# EAGLE design mgpcbw02 (EAGLE 7.6.0)
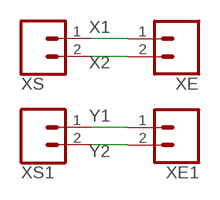
[diagram p0: schematic, sheet 1]

## Parts
XE  CONN_021X02_NO_SILK  [1X02_NO_SILK]
XE1  CONN_021X02_NO_SILK  [1X02_NO_SILK]
XS  CONN_021X02_NO_SILK  [1X02_NO_SILK]
XS1  CONN_021X02_NO_SILK  [1X02_NO_SILK]

## Nets
X1: XE.1 XS.1
X2: XE.2 XS.2
Y1: XE1.1 XS1.1
Y2: XE1.2 XS1.2

## Library data of the parts
XE XE1 XS XS1 = SparkFun-Connectors:CONN_02: Multi connection point. Often used as Generic Header-pin footprint for 0.1 inch spaced/style header connections On any of the 0.1 inch spaced packages, you can populate with these: Break Away Headers - Straight <https://www.sparkfun.com/products/116> (PRT-00116) Break Away Male Headers - Right Angle <https://www.sparkfun.com/products/553> (PRT-00553) Female Headers <https://www.sparkfun.com/products/115> (PRT-00115) Break Away Headers - Machine Pin <https://www.sparkfun.com/products/117> (PRT-00117) Break Away Female Headers - Swiss Machine Pin <https://www.sparkfun.com/products/743> (PRT-00743) For SCREWTERMINALS and SPRING TERMINALS visit here: Screw Terimnals on SparkFun.com <https://www.sparkfun.com/search/results?term=Screw+Terminals> (5mm/3.5mm/2.54mm spacing) This device is also useful as a general connection point to wire up your design to another part of your project. Our various solder wires solder well into these plated through hole pads. Hook-Up Wire - Assortment (Stranded, 22 AWG) <https://www.sparkfun.com/products/11375> (PRT-11375) Hook-Up Wire - Assortment (Solid Core, 22 AWG) <https://www.sparkfun.com/products/11367> (PRT-11367) View the entire wire category on our website here <https://www.sparkfun.com/categories/141> Special notes: Molex polarized connector foot print use with: PRT-08233 with associated crimp pins and housings. 2.54_SCREWTERM for use with PRT-10571. 3.5mm Screw Terminal footprints for PRT-08084 5mm Screw Terminal footprints for use with PRT-08432

## Net classes
0 default: width 0.203 mm, drill 0.381 mm, clearance 0.203 mm
1 vcc: width 0.305 mm, drill 0.381 mm, clearance 0.254 mm
2 gnd: width 0.305 mm, drill 0.381 mm, clearance 0.254 mm

## Board
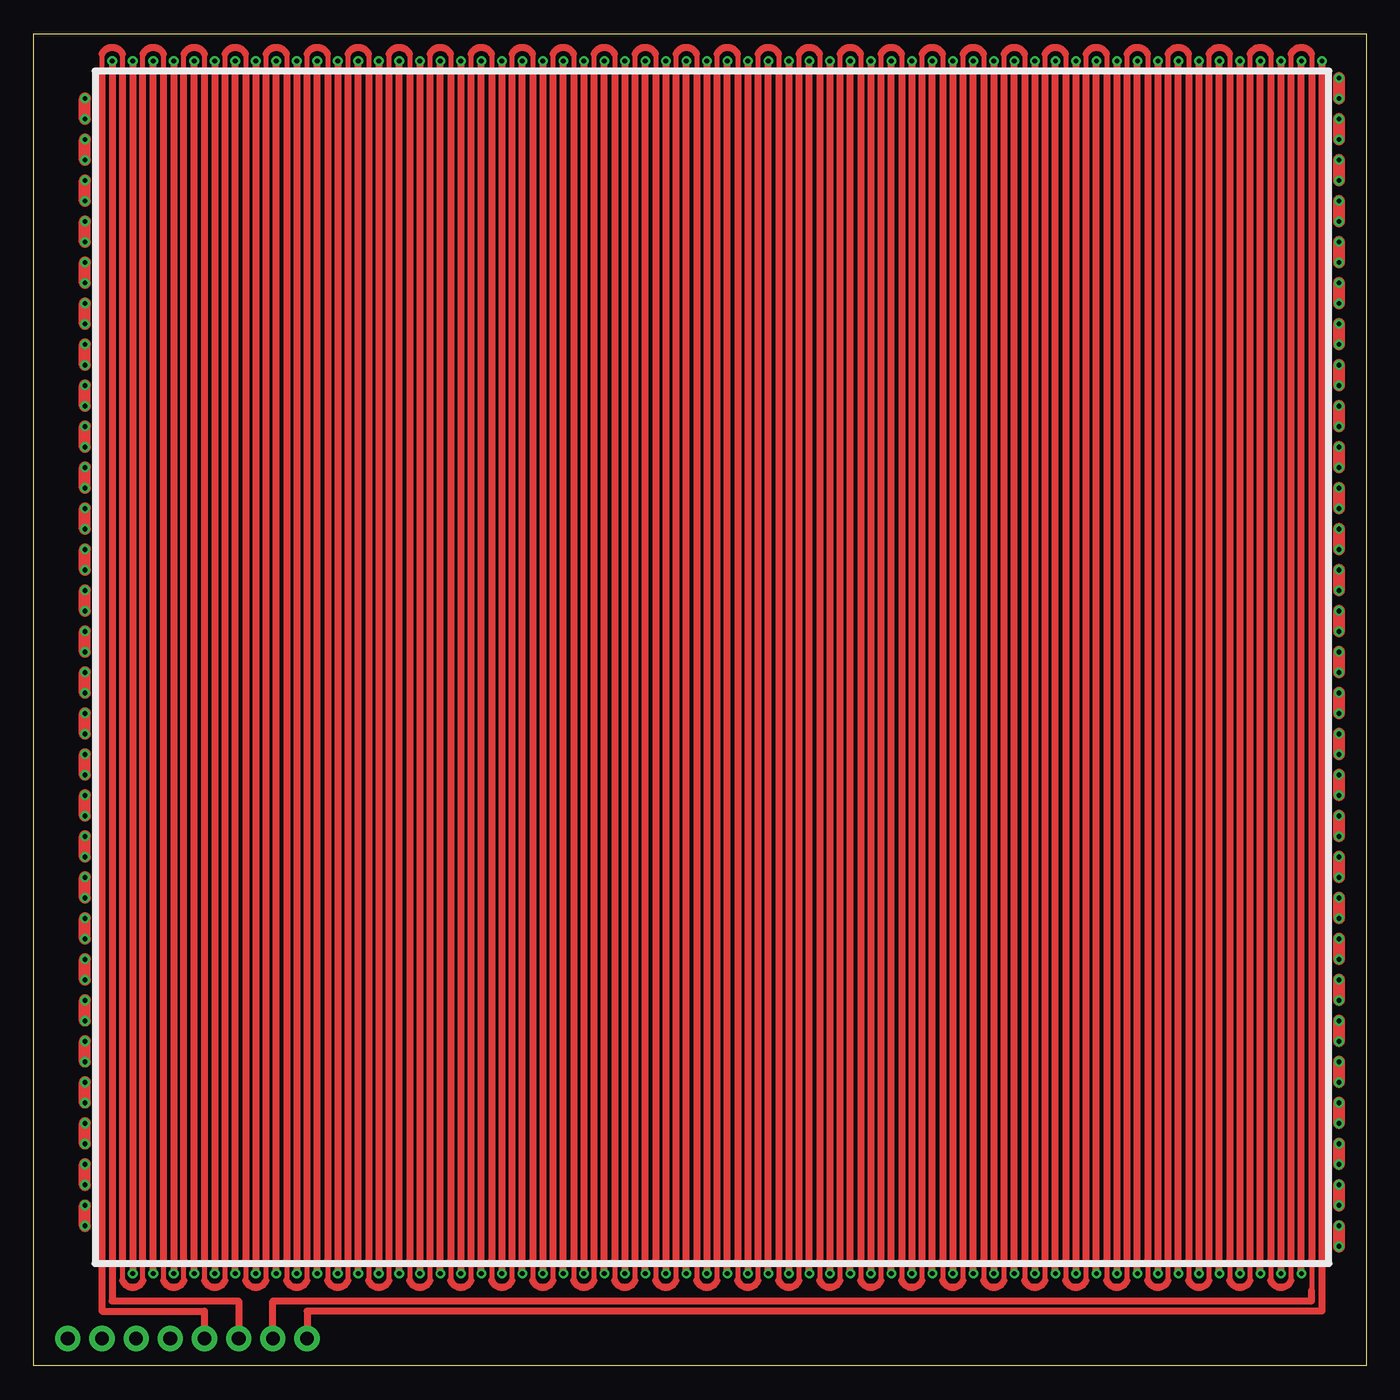
[diagram p1: board, top side]
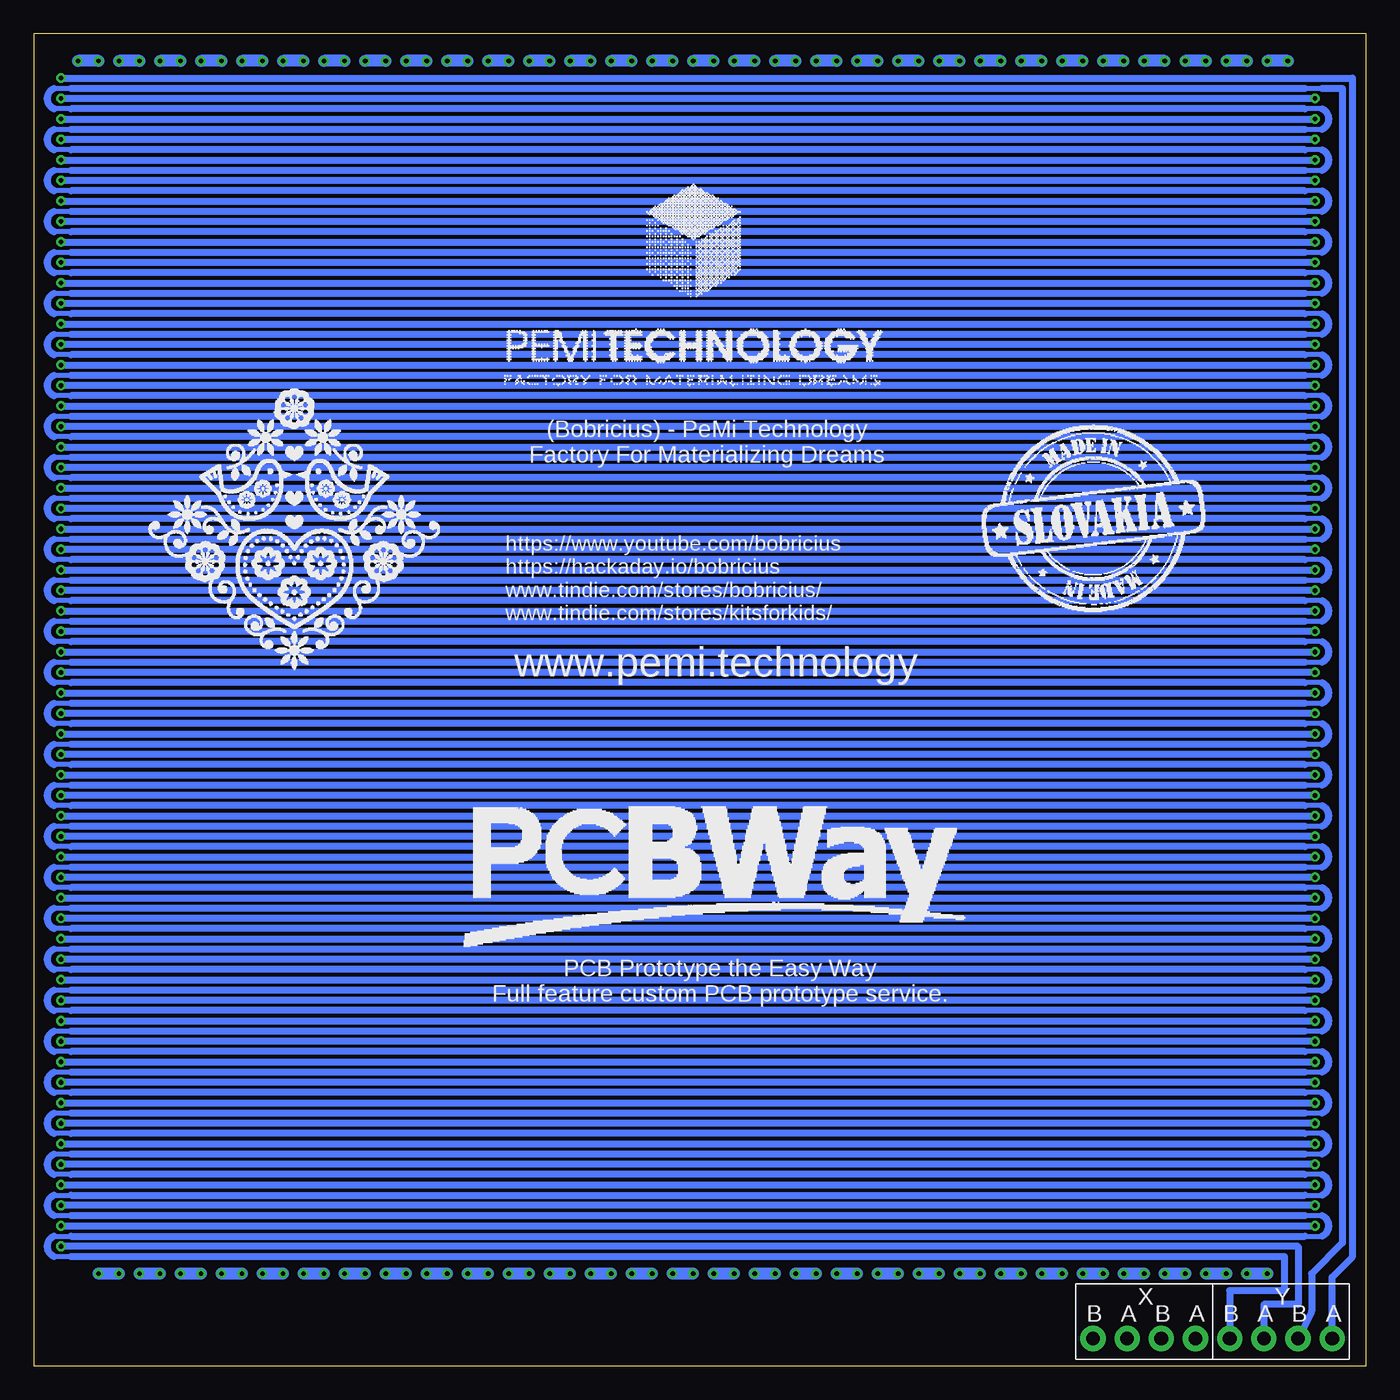
[diagram p2: board, bottom side, seen from below]

Size 99.06 x 99.06 mm. Coordinates in mm from the lower left corner, seen from the top.
Outline: 0,99.06 99.06,99.06 99.06,0 0,0 0,99.06
Copper layers (1*16): Top 0.0356mm / dielectric 1.5011mm / Bottom 0.0356mm
Design rules "LaenPCBOrder *": minimum track width 6mil, minimum drill 13mil, track to track 6mil, track to pad 6mil, pad to pad 6mil, via to via 6mil, smd to smd 6mil, copper to edge 15mil, drill to drill 6mil, minimum pad ring 7mil, minimum via ring 7mil, stop-mask expansion 4mil, vias tented up to drill 100mil, thermal gap 10mil

### Footprints (pad centres in the part's own frame; a part is rotated, then mirrored left to right if it is on the bottom)
1X02_NO_SILK = drill 1.016 pad 1.88: 1 0,0; 2 2.54,0

### Placement (x,y rotation side)
XE  17.78,2.03 0 top
XE1  10.16,2.03 180 top
XS  12.7,2.03 0 top
XS1  5.08,2.03 180 top

### Tracks (layer width: path | path; a pad name or v marks a point on that pad's centre or on a via)
X1
  Top 0.381: 6.6,97.54 6.6,96.27 | 6.6,7.87 6.6,6.35 | 8.13,6.35 8.13,7.87 | 8.13,96.27 8.13,97.54 | 9.65,97.54 9.65,96.27 | 9.65,7.87 9.65,6.35 | 11.18,6.35 11.18,7.87 | 11.18,96.27 11.18,97.54 | 12.7,97.54 12.7,96.27 | 12.7,7.87 12.7,6.35 | 14.22,6.35 14.22,7.87 | 14.22,96.27 14.22,97.54 | 15.75,97.54 15.75,96.27 | 15.75,7.87 15.75,6.35 | 17.27,6.35 17.27,7.87 | 17.27,96.27 17.27,97.54 | 18.8,97.54 18.8,96.27 | 18.8,7.87 18.8,6.35 | 20.32,6.35 20.32,7.87 | 20.32,96.27 20.32,97.54 | 21.84,97.54 21.84,96.27 | 21.84,7.87 21.84,6.35 | 23.37,6.35 23.37,7.87 | 23.37,96.27 23.37,97.54 | 24.89,97.54 24.89,96.27 | 24.89,7.87 24.89,6.35 | 26.42,6.35 26.42,7.87 | 26.42,96.27 26.42,97.54 | 27.94,97.54 27.94,96.27 | 27.94,7.87 27.94,6.35 | 29.46,6.35 29.46,7.87 | 29.46,96.27 29.46,97.54 | 30.99,97.54 30.99,96.27 | 30.99,7.87 30.99,6.35 | 32.51,6.35 32.51,7.87 | 32.51,96.27 32.51,97.54 | 34.04,97.54 34.04,96.27 | 34.04,7.87 34.04,6.35 | 35.56,6.35 35.56,7.87 | 35.56,96.27 35.56,97.54 | 37.08,97.54 37.08,96.27 | 37.08,7.87 37.08,6.35 | 38.61,6.35 38.61,7.87 | 38.61,96.27 38.61,97.54 | 40.13,97.54 40.13,96.27 | 40.13,7.87 40.13,6.35 | 41.66,6.35 41.66,7.87 | 41.66,96.27 41.66,97.54 | 43.18,97.54 43.18,96.27 | 43.18,7.87 43.18,6.35 | 44.7,6.35 44.7,7.87 | 44.7,96.27 44.7,97.54 | 46.23,97.54 46.23,96.27 | 46.23,7.87 46.23,6.35 | 47.75,6.35 47.75,7.87 | 47.75,96.27 47.75,97.54 | 49.28,97.54 49.28,96.27 | 49.28,7.87 49.28,6.35 | 50.8,6.35 50.8,7.87 | 50.8,96.27 50.8,97.54 | 52.32,97.54 52.32,96.27 | 52.32,7.87 52.32,6.35 | 53.85,6.35 53.85,7.87 | 53.85,96.27 53.85,97.54 | 55.37,97.54 55.37,96.27 | 55.37,7.87 55.37,6.35 | 56.9,6.35 56.9,7.87 | 56.9,96.27 56.9,97.54 | 58.42,97.54 58.42,96.27 | 58.42,7.87 58.42,6.35
  Top 0.381: 59.94,6.35 59.94,7.87 | 59.94,96.27 59.94,97.54 | 61.47,97.54 61.47,96.27 | 61.47,7.87 61.47,6.35 | 62.99,6.35 62.99,7.87 | 62.99,96.27 62.99,97.54 | 64.52,97.54 64.52,96.27 | 64.52,7.87 64.52,6.35 | 66.04,6.35 66.04,7.87 | 66.04,96.27 66.04,97.54 | 67.56,97.54 67.56,96.27 | 67.56,7.87 67.56,6.35 | 69.09,6.35 69.09,7.87 | 69.09,96.27 69.09,97.54 | 70.61,97.54 70.61,96.27 | 70.61,7.87 70.61,6.35 | 72.14,6.35 72.14,7.87 | 72.14,96.27 72.14,97.54 | 73.66,97.54 73.66,96.27 | 73.66,7.87 73.66,6.35 | 75.18,6.35 75.18,7.87 | 75.18,96.27 75.18,97.54 | 76.71,97.54 76.71,96.27 | 76.71,7.87 76.71,6.35 | 78.23,6.35 78.23,7.87 | 78.23,96.27 78.23,97.54 | 5.08,97.54 5.08,96.27 | 79.76,97.54 79.76,96.27 | 79.76,7.87 79.76,6.35 | 81.28,6.35 81.28,7.87 | 81.28,96.27 81.28,97.54 | 82.8,97.54 82.8,96.27 | 82.8,7.87 82.8,6.35 | 84.33,6.35 84.33,7.87 | 84.33,96.27 84.33,97.54 | 85.85,97.54 85.85,96.27 | 85.85,7.87 85.85,6.35 | 87.38,6.35 87.38,7.87 | 87.38,96.27 87.38,97.54 | 88.9,97.54 88.9,96.27 | 88.9,7.87 88.9,6.35 | 90.42,6.35 90.42,7.87 | 90.42,96.27 90.42,97.54 | 91.95,97.54 91.95,96.27 | 91.95,7.87 91.95,6.35 | 93.47,6.35 93.47,7.87 | 93.47,96.27 93.47,97.54 | 95,97.54 95,96.27 | 95,7.87 95,5.59
  Top 0.508: 5.08,97.54 arc-135 6.6,97.54 | 6.6,96.27 6.6,7.87 | 6.6,6.35 arc135 8.13,6.35 | 8.13,7.87 8.13,96.27 | 8.13,97.54 arc-135 9.65,97.54 | 9.65,96.27 9.65,7.87 | 9.65,6.35 arc135 11.18,6.35 | 11.18,7.87 11.18,96.27 | 11.18,97.54 arc-135 12.7,97.54 | 12.7,96.27 12.7,7.87 | 12.7,6.35 arc135 14.22,6.35 | 14.22,7.87 14.22,96.27 | 14.22,97.54 arc-135 15.75,97.54 | 15.75,96.27 15.75,7.87 | 15.75,6.35 arc135 17.27,6.35 | 17.27,7.87 17.27,96.27 | 17.27,97.54 arc-135 18.8,97.54 | 18.8,96.27 18.8,7.87 | 18.8,6.35 arc135 20.32,6.35 | 20.32,7.87 20.32,96.27 | 20.32,97.54 arc-135 21.84,97.54 | 21.84,96.27 21.84,7.87 | 21.84,6.35 arc135 23.37,6.35 | 23.37,7.87 23.37,96.27 | 23.37,97.54 arc-135 24.89,97.54 | 24.89,96.27 24.89,7.87 | 24.89,6.35 arc135 26.42,6.35 | 26.42,7.87 26.42,96.27 | 26.42,97.54 arc-135 27.94,97.54 | 27.94,96.27 27.94,7.87 | 27.94,6.35 arc135 29.46,6.35 | 29.46,7.87 29.46,96.27 | 29.46,97.54 arc-135 30.99,97.54 | 30.99,96.27 30.99,7.87 | 30.99,6.35 arc135 32.51,6.35 | 32.51,7.87 32.51,96.27 | 32.51,97.54 arc-135 34.04,97.54 | 34.04,96.27 34.04,7.87 | 34.04,6.35 arc135 35.56,6.35 | 35.56,7.87 35.56,96.27 | 35.56,97.54 arc-135 37.08,97.54 | 37.08,96.27 37.08,7.87 | 37.08,6.35 arc135 38.61,6.35 | 38.61,7.87 38.61,96.27 | 38.61,97.54 arc-135 40.13,97.54 | 40.13,96.27 40.13,7.87 | 40.13,6.35 arc135 41.66,6.35 | 41.66,7.87 41.66,96.27 | 41.66,97.54 arc-135 43.18,97.54 | 43.18,96.27 43.18,7.87 | 43.18,6.35 arc135 44.7,6.35 | 44.7,7.87 44.7,96.27 | 44.7,97.54 arc-135 46.23,97.54 | 46.23,96.27 46.23,7.87 | 46.23,6.35 arc135 47.75,6.35 | 47.75,7.87 47.75,96.27 | 47.75,97.54 arc-135 49.28,97.54 | 49.28,96.27 49.28,7.87 | 49.28,6.35 arc135 50.8,6.35 | 50.8,7.87 50.8,96.27
  Top 0.508: 50.8,97.54 arc-135 52.32,97.54 | 52.32,96.27 52.32,7.87 | 52.32,6.35 arc135 53.85,6.35 | 53.85,7.87 53.85,96.27 | 53.85,97.54 arc-135 55.37,97.54 | 55.37,96.27 55.37,7.87 | 55.37,6.35 arc135 56.9,6.35 | 56.9,7.87 56.9,96.27 | 56.9,97.54 arc-135 58.42,97.54 | 58.42,96.27 58.42,7.87 | 58.42,6.35 arc135 59.94,6.35 | 59.94,7.87 59.94,96.27 | 59.94,97.54 arc-135 61.47,97.54 | 61.47,96.27 61.47,7.87 | 61.47,6.35 arc135 62.99,6.35 | 62.99,7.87 62.99,96.27 | 62.99,97.54 arc-135 64.52,97.54 | 64.52,96.27 64.52,7.87 | 64.52,6.35 arc135 66.04,6.35 | 66.04,7.87 66.04,96.27 | 66.04,97.54 arc-135 67.56,97.54 | 67.56,96.27 67.56,7.87 | 67.56,6.35 arc135 69.09,6.35 | 69.09,7.87 69.09,96.27 | 69.09,97.54 arc-135 70.61,97.54 | 70.61,96.27 70.61,7.87 | 70.61,6.35 arc135 72.14,6.35 | 72.14,7.87 72.14,96.27 | 72.14,97.54 arc-135 73.66,97.54 | 73.66,96.27 73.66,7.87 | 73.66,6.35 arc135 75.18,6.35 | 75.18,7.87 75.18,96.27 | 75.18,97.54 arc-135 76.71,97.54 | 76.71,96.27 76.71,7.87 | 76.71,6.35 arc135 78.23,6.35 | 78.23,7.87 78.23,96.27 | 5.08,96.27 5.08,4.06 12.7,4.06 XS.1 | 78.23,97.54 arc-135 79.76,97.54 | 79.76,96.27 79.76,7.87 | 79.76,6.35 arc135 81.28,6.35 | 81.28,7.87 81.28,96.27 | 81.28,97.54 arc-135 82.8,97.54 | 82.8,96.27 82.8,7.87 | 82.8,6.35 arc135 84.33,6.35 | 84.33,7.87 84.33,96.27 | 84.33,97.54 arc-135 85.85,97.54 | 85.85,96.27 85.85,7.87 | 85.85,6.35 arc135 87.38,6.35 | 87.38,7.87 87.38,96.27 | 87.38,97.54 arc-135 88.9,97.54 | 88.9,96.27 88.9,7.87 | 88.9,6.35 arc135 90.42,6.35 | 90.42,7.87 90.42,96.27 | 90.42,97.54 arc-135 91.95,97.54 | 91.95,96.27 91.95,7.87 | 91.95,6.35 arc135 93.47,6.35 | 93.47,7.87 93.47,96.27 | 93.47,97.54 arc-135 95,97.54 | 95,96.27 95,7.87
  Top 0.508: XE.1 17.78,4.83 95,4.83 95,5.59
X2  (via drill 0.36, 0.36 pad 0.51)
  Top 0.508: v7.37,97.03 v7.37,6.86 | v8.89,6.86 v8.89,97.03 | v10.41,97.03 v10.41,6.86 | v11.94,6.86 v11.94,97.03 | v13.46,97.03 v13.46,6.86 | v14.99,6.86 v14.99,97.03 | v16.51,97.03 v16.51,6.86 | v18.03,6.86 v18.03,97.03 | v19.56,97.03 v19.56,6.86 | v21.08,6.86 v21.08,97.03 | v22.61,97.03 v22.61,6.86 | v24.13,6.86 v24.13,97.03 | v25.65,97.03 v25.65,6.86 | v27.18,6.86 v27.18,97.03 | v28.7,97.03 v28.7,6.86 | v30.23,6.86 v30.23,97.03 | v31.75,97.03 v31.75,6.86 | v33.27,6.86 v33.27,97.03 | v34.8,97.03 v34.8,6.86 | v36.32,6.86 v36.32,97.03 | v37.85,97.03 v37.85,6.86 | v39.37,6.86 v39.37,97.03 | v40.89,97.03 v40.89,6.86 | v42.42,6.86 v42.42,97.03 | v43.94,97.03 v43.94,6.86 | v45.47,6.86 v45.47,97.03 | v46.99,97.03 v46.99,6.86 | v48.51,6.86 v48.51,97.03 | v50.04,97.03 v50.04,6.86 | v51.56,6.86 v51.56,97.03 | v53.09,97.03 v53.09,6.86 | v54.61,6.86 v54.61,97.03 | v56.13,97.03 v56.13,6.86 | v57.66,6.86 v57.66,97.03 | v59.18,97.03 v59.18,6.86 | v60.71,6.86 v60.71,97.03 | v62.23,97.03 v62.23,6.86 | v63.75,6.86 v63.75,97.03 | v65.28,97.03 v65.28,6.86 | v66.8,6.86 v66.8,97.03 | v68.33,97.03 v68.33,6.86 | v69.85,6.86 v69.85,97.03 | v71.37,97.03 v71.37,6.86 | v72.9,6.86 v72.9,97.03 | v74.42,97.03 v74.42,6.86 | v75.95,6.86 v75.95,97.03 | v77.47,97.03 v77.47,6.86 | v78.99,6.86 v78.99,97.03 | v5.84,97.03 5.84,4.83 15.24,4.83 XS.2 | v80.52,97.03 v80.52,6.86 | v82.04,6.86 v82.04,97.03 | v83.57,97.03 v83.57,6.86 | v85.09,6.86 v85.09,97.03 | v86.61,97.03 v86.61,6.86 | v88.14,6.86 v88.14,97.03 | v89.66,97.03 v89.66,6.86 | v91.19,6.86 v91.19,97.03 | v92.71,97.03 v92.71,6.86 | v94.23,6.86 v94.23,97.03 | v95.76,97.03 95.76,4.06 20.32,4.06 XE.2
  Bottom 0.889: v5.84,97.03 v7.37,97.03 | v7.37,6.86 v8.89,6.86 | v8.89,97.03 v10.41,97.03 | v10.41,6.86 v11.94,6.86 | v11.94,97.03 v13.46,97.03 | v13.46,6.86 v14.99,6.86 | v14.99,97.03 v16.51,97.03 | v16.51,6.86 v18.03,6.86 | v18.03,97.03 v19.56,97.03 | v19.56,6.86 v21.08,6.86 | v21.08,97.03 v22.61,97.03 | v22.61,6.86 v24.13,6.86 | v24.13,97.03 v25.65,97.03 | v25.65,6.86 v27.18,6.86 | v27.18,97.03 v28.7,97.03 | v28.7,6.86 v30.23,6.86 | v30.23,97.03 v31.75,97.03 | v31.75,6.86 v33.27,6.86 | v33.27,97.03 v34.8,97.03 | v34.8,6.86 v36.32,6.86 | v36.32,97.03 v37.85,97.03 | v37.85,6.86 v39.37,6.86 | v39.37,97.03 v40.89,97.03 | v40.89,6.86 v42.42,6.86 | v42.42,97.03 v43.94,97.03 | v43.94,6.86 v45.47,6.86 | v45.47,97.03 v46.99,97.03 | v46.99,6.86 v48.51,6.86 | v48.51,97.03 v50.04,97.03 | v50.04,6.86 v51.56,6.86 | v51.56,97.03 v53.09,97.03 | v53.09,6.86 v54.61,6.86 | v54.61,97.03 v56.13,97.03 | v56.13,6.86 v57.66,6.86 | v57.66,97.03 v59.18,97.03 | v59.18,6.86 v60.71,6.86 | v60.71,97.03 v62.23,97.03 | v62.23,6.86 v63.75,6.86 | v63.75,97.03 v65.28,97.03 | v65.28,6.86 v66.8,6.86 | v66.8,97.03 v68.33,97.03 | v68.33,6.86 v69.85,6.86 | v69.85,97.03 v71.37,97.03 | v71.37,6.86 v72.9,6.86 | v72.9,97.03 v74.42,97.03 | v74.42,6.86 v75.95,6.86 | v75.95,97.03 v77.47,97.03 | v77.47,6.86 v78.99,6.86 | v78.99,97.03 v80.52,97.03 | v80.52,6.86 v82.04,6.86 | v82.04,97.03 v83.57,97.03 | v83.57,6.86 v85.09,6.86 | v85.09,97.03 v86.61,97.03 | v86.61,6.86 v88.14,6.86 | v88.14,97.03 v89.66,97.03 | v89.66,6.86 v91.19,6.86 | v91.19,97.03 v92.71,97.03 | v92.71,6.86 v94.23,6.86 | v94.23,97.03 v95.76,97.03
Y1
  Bottom 0.381: 96.27,8.13 97.54,8.13 | 97.54,9.65 96.27,9.65 | 4.57,9.65 3.3,9.65 | 3.3,11.18 4.57,11.18 | 96.27,11.18 97.54,11.18 | 97.54,12.7 96.27,12.7 | 4.57,12.7 3.3,12.7 | 3.3,14.22 4.57,14.22 | 96.27,14.22 97.54,14.22 | 97.54,15.75 96.27,15.75 | 4.57,15.75 3.3,15.75 | 3.3,17.27 4.57,17.27 | 96.27,17.27 97.54,17.27 | 97.54,18.8 96.27,18.8 | 4.57,18.8 3.3,18.8 | 3.3,20.32 4.57,20.32 | 96.27,20.32 97.54,20.32 | 97.54,21.84 96.27,21.84 | 4.57,21.84 3.3,21.84 | 3.3,23.37 4.57,23.37 | 96.27,23.37 97.54,23.37 | 97.54,24.89 96.27,24.89 | 4.57,24.89 3.3,24.89 | 3.3,26.42 4.57,26.42 | 96.27,26.42 97.54,26.42 | 97.54,27.94 96.27,27.94 | 4.57,27.94 3.3,27.94 | 3.3,29.46 4.57,29.46 | 96.27,29.46 97.54,29.46 | 97.54,30.99 96.27,30.99 | 4.57,30.99 3.3,30.99 | 3.3,32.51 4.57,32.51 | 96.27,32.51 97.54,32.51 | 97.54,34.04 96.27,34.04 | 4.57,34.04 3.3,34.04 | 3.3,35.56 4.57,35.56 | 96.27,35.56 97.54,35.56 | 97.54,37.08 96.27,37.08 | 4.57,37.08 3.3,37.08 | 3.3,38.61 4.57,38.61 | 96.27,38.61 97.54,38.61 | 97.54,40.13 96.27,40.13 | 4.57,40.13 3.3,40.13 | 3.3,41.66 4.57,41.66 | 96.27,41.66 97.54,41.66 | 97.54,43.18 96.27,43.18 | 4.57,43.18 3.3,43.18 | 3.3,44.7 4.57,44.7 | 96.27,44.7 97.54,44.7 | 97.54,46.23 96.27,46.23 | 4.57,46.23 3.3,46.23 | 3.3,47.75 4.57,47.75 | 96.27,47.75 97.54,47.75 | 97.54,49.28 96.27,49.28 | 4.57,49.28 3.3,49.28 | 3.3,50.8 4.57,50.8 | 96.27,50.8 97.54,50.8 | 97.54,52.32 96.27,52.32 | 4.57,52.32 3.3,52.32 | 3.3,53.85 4.57,53.85 | 96.27,53.85 97.54,53.85 | 97.54,55.37 96.27,55.37 | 4.57,55.37 3.3,55.37 | 3.3,56.9 4.57,56.9 | 96.27,56.9 97.54,56.9 | 97.54,58.42 96.27,58.42 | 4.57,58.42 3.3,58.42 | 3.3,59.94 4.57,59.94 | 96.27,59.94 97.54,59.94 | 97.54,61.47 96.27,61.47 | 4.57,61.47 3.3,61.47
  Bottom 0.381: 3.3,62.99 4.57,62.99 | 96.27,62.99 97.54,62.99 | 97.54,64.52 96.27,64.52 | 4.57,64.52 3.3,64.52 | 3.3,66.04 4.57,66.04 | 96.27,66.04 97.54,66.04 | 97.54,67.56 96.27,67.56 | 4.57,67.56 3.3,67.56 | 3.3,69.09 4.57,69.09 | 96.27,69.09 97.54,69.09 | 97.54,70.61 96.27,70.61 | 4.57,70.61 3.3,70.61 | 3.3,72.14 4.57,72.14 | 96.27,72.14 97.54,72.14 | 97.54,73.66 96.27,73.66 | 4.57,73.66 3.3,73.66 | 3.3,75.18 4.57,75.18 | 96.27,75.18 97.54,75.18 | 97.54,76.71 96.27,76.71 | 4.57,76.71 3.3,76.71 | 3.3,78.23 4.57,78.23 | 96.27,78.23 97.54,78.23 | 97.54,79.76 96.27,79.76 | 4.57,79.76 3.3,79.76 | 3.3,81.28 4.57,81.28 | 96.27,81.28 97.54,81.28 | 97.54,82.8 96.27,82.8 | 4.57,82.8 3.3,82.8 | 3.3,84.33 4.57,84.33 | 96.27,84.33 97.54,84.33 | 97.54,85.85 96.27,85.85 | 4.57,85.85 3.3,85.85 | 3.3,87.38 4.57,87.38 | 96.27,87.38 97.54,87.38 | 97.54,88.9 96.27,88.9 | 4.57,88.9 3.3,88.9 | 3.3,90.42 4.57,90.42 | 96.27,90.42 97.54,90.42 | 97.54,91.95 96.27,91.95 | 4.57,91.95 3.3,91.95 | 3.3,93.47 4.57,93.47 | 96.27,93.47 97.54,93.47 | 97.54,95 96.27,95 | 4.57,95 3.3,95
  Bottom 0.508: 96.27,8.13 6.1,8.13 6.1,5.59 10.16,5.59 XE1.1 | 97.54,8.13 arc135 97.54,9.65 | 96.27,9.65 4.57,9.65 | 3.3,9.65 arc-135 3.3,11.18 | 4.57,11.18 96.27,11.18 | 97.54,11.18 arc135 97.54,12.7 | 96.27,12.7 4.57,12.7 | 3.3,12.7 arc-135 3.3,14.22 | 4.57,14.22 96.27,14.22 | 97.54,14.22 arc135 97.54,15.75 | 96.27,15.75 4.57,15.75 | 3.3,15.75 arc-135 3.3,17.27 | 4.57,17.27 96.27,17.27 | 97.54,17.27 arc135 97.54,18.8 | 96.27,18.8 4.57,18.8 | 3.3,18.8 arc-135 3.3,20.32 | 4.57,20.32 96.27,20.32 | 97.54,20.32 arc135 97.54,21.84 | 96.27,21.84 4.57,21.84 | 3.3,21.84 arc-135 3.3,23.37 | 4.57,23.37 96.27,23.37 | 97.54,23.37 arc135 97.54,24.89 | 96.27,24.89 4.57,24.89 | 3.3,24.89 arc-135 3.3,26.42 | 4.57,26.42 96.27,26.42 | 97.54,26.42 arc135 97.54,27.94 | 96.27,27.94 4.57,27.94 | 3.3,27.94 arc-135 3.3,29.46 | 4.57,29.46 96.27,29.46 | 97.54,29.46 arc135 97.54,30.99 | 96.27,30.99 4.57,30.99 | 3.3,30.99 arc-135 3.3,32.51 | 4.57,32.51 96.27,32.51 | 97.54,32.51 arc135 97.54,34.04 | 96.27,34.04 4.57,34.04 | 3.3,34.04 arc-135 3.3,35.56 | 4.57,35.56 96.27,35.56 | 97.54,35.56 arc135 97.54,37.08 | 96.27,37.08 4.57,37.08 | 3.3,37.08 arc-135 3.3,38.61 | 4.57,38.61 96.27,38.61 | 97.54,38.61 arc135 97.54,40.13 | 96.27,40.13 4.57,40.13 | 3.3,40.13 arc-135 3.3,41.66 | 4.57,41.66 96.27,41.66 | 97.54,41.66 arc135 97.54,43.18 | 96.27,43.18 4.57,43.18 | 3.3,43.18 arc-135 3.3,44.7 | 4.57,44.7 96.27,44.7 | 97.54,44.7 arc135 97.54,46.23 | 96.27,46.23 4.57,46.23 | 3.3,46.23 arc-135 3.3,47.75 | 4.57,47.75 96.27,47.75 | 97.54,47.75 arc135 97.54,49.28 | 96.27,49.28 4.57,49.28 | 3.3,49.28 arc-135 3.3,50.8 | 4.57,50.8 96.27,50.8 | 97.54,50.8 arc135 97.54,52.32 | 96.27,52.32 4.57,52.32 | 3.3,52.32 arc-135 3.3,53.85
  Bottom 0.508: 4.57,53.85 96.27,53.85 | 97.54,53.85 arc135 97.54,55.37 | 96.27,55.37 4.57,55.37 | 3.3,55.37 arc-135 3.3,56.9 | 4.57,56.9 96.27,56.9 | 97.54,56.9 arc135 97.54,58.42 | 96.27,58.42 4.57,58.42 | 3.3,58.42 arc-135 3.3,59.94 | 4.57,59.94 96.27,59.94 | 97.54,59.94 arc135 97.54,61.47 | 96.27,61.47 4.57,61.47 | 3.3,61.47 arc-135 3.3,62.99 | 4.57,62.99 96.27,62.99 | 97.54,62.99 arc135 97.54,64.52 | 96.27,64.52 4.57,64.52 | 3.3,64.52 arc-135 3.3,66.04 | 4.57,66.04 96.27,66.04 | 97.54,66.04 arc135 97.54,67.56 | 96.27,67.56 4.57,67.56 | 3.3,67.56 arc-135 3.3,69.09 | 4.57,69.09 96.27,69.09 | 97.54,69.09 arc135 97.54,70.61 | 96.27,70.61 4.57,70.61 | 3.3,70.61 arc-135 3.3,72.14 | 4.57,72.14 96.27,72.14 | 97.54,72.14 arc135 97.54,73.66 | 96.27,73.66 4.57,73.66 | 3.3,73.66 arc-135 3.3,75.18 | 4.57,75.18 96.27,75.18 | 97.54,75.18 arc135 97.54,76.71 | 96.27,76.71 4.57,76.71 | 3.3,76.71 arc-135 3.3,78.23 | 4.57,78.23 96.27,78.23 | 97.54,78.23 arc135 97.54,79.76 | 96.27,79.76 4.57,79.76 | 3.3,79.76 arc-135 3.3,81.28 | 4.57,81.28 96.27,81.28 | 97.54,81.28 arc135 97.54,82.8 | 96.27,82.8 4.57,82.8 | 3.3,82.8 arc-135 3.3,84.33 | 4.57,84.33 96.27,84.33 | 97.54,84.33 arc135 97.54,85.85 | 96.27,85.85 4.57,85.85 | 3.3,85.85 arc-135 3.3,87.38 | 4.57,87.38 96.27,87.38 | 97.54,87.38 arc135 97.54,88.9 | 96.27,88.9 4.57,88.9 | 3.3,88.9 arc-135 3.3,90.42 | 4.57,90.42 96.27,90.42 | 97.54,90.42 arc135 97.54,91.95 | 96.27,91.95 4.57,91.95 | 3.3,91.95 arc-135 3.3,93.47 | 4.57,93.47 96.27,93.47 | 97.54,93.47 arc135 97.54,95 | 96.27,95 4.57,95 | 3.3,95 1.78,95 1.78,9.14 4.06,6.86 4.06,4.06 XS1.1
Y2  (via drill 0.36, 0.36 pad 0.51)
  Top 0.889: v97.03,8.89 v97.03,10.41 | v3.81,10.41 v3.81,11.94 | v97.03,11.94 v97.03,13.46 | v3.81,13.46 v3.81,14.99 | v97.03,14.99 v97.03,16.51 | v3.81,16.51 v3.81,18.03 | v97.03,18.03 v97.03,19.56 | v3.81,19.56 v3.81,21.08 | v97.03,21.08 v97.03,22.61 | v3.81,22.61 v3.81,24.13 | v97.03,24.13 v97.03,25.65 | v3.81,25.65 v3.81,27.18 | v97.03,27.18 v97.03,28.7 | v3.81,28.7 v3.81,30.23 | v97.03,30.23 v97.03,31.75 | v3.81,31.75 v3.81,33.27 | v97.03,33.27 v97.03,34.8 | v3.81,34.8 v3.81,36.32 | v97.03,36.32 v97.03,37.85 | v3.81,37.85 v3.81,39.37 | v97.03,39.37 v97.03,40.89 | v3.81,40.89 v3.81,42.42 | v97.03,42.42 v97.03,43.94 | v3.81,43.94 v3.81,45.47 | v97.03,45.47 v97.03,46.99 | v3.81,46.99 v3.81,48.51 | v97.03,48.51 v97.03,50.04 | v3.81,50.04 v3.81,51.56 | v97.03,51.56 v97.03,53.09 | v3.81,53.09 v3.81,54.61 | v97.03,54.61 v97.03,56.13 | v3.81,56.13 v3.81,57.66 | v97.03,57.66 v97.03,59.18 | v3.81,59.18 v3.81,60.71 | v97.03,60.71 v97.03,62.23 | v3.81,62.23 v3.81,63.75 | v97.03,63.75 v97.03,65.28 | v3.81,65.28 v3.81,66.8 | v97.03,66.8 v97.03,68.33 | v3.81,68.33 v3.81,69.85 | v97.03,69.85 v97.03,71.37 | v3.81,71.37 v3.81,72.9 | v97.03,72.9 v97.03,74.42 | v3.81,74.42 v3.81,75.95 | v97.03,75.95 v97.03,77.47 | v3.81,77.47 v3.81,78.99 | v97.03,78.99 v97.03,80.52 | v3.81,80.52 v3.81,82.04 | v97.03,82.04 v97.03,83.57 | v3.81,83.57 v3.81,85.09 | v97.03,85.09 v97.03,86.61 | v3.81,86.61 v3.81,88.14 | v97.03,88.14 v97.03,89.66 | v3.81,89.66 v3.81,91.19 | v97.03,91.19 v97.03,92.71 | v3.81,92.71 v3.81,94.23 | v97.03,94.23 v97.03,95.76
  Bottom 0.508: v97.03,8.89 5.08,8.89 5.08,4.57 7.62,4.57 XE1.2 | v97.03,10.41 v3.81,10.41 | v3.81,11.94 v97.03,11.94 | v97.03,13.46 v3.81,13.46 | v3.81,14.99 v97.03,14.99 | v97.03,16.51 v3.81,16.51 | v3.81,18.03 v97.03,18.03 | v97.03,19.56 v3.81,19.56 | v3.81,21.08 v97.03,21.08 | v97.03,22.61 v3.81,22.61 | v3.81,24.13 v97.03,24.13 | v97.03,25.65 v3.81,25.65 | v3.81,27.18 v97.03,27.18 | v97.03,28.7 v3.81,28.7 | v3.81,30.23 v97.03,30.23 | v97.03,31.75 v3.81,31.75 | v3.81,33.27 v97.03,33.27 | v97.03,34.8 v3.81,34.8 | v3.81,36.32 v97.03,36.32 | v97.03,37.85 v3.81,37.85 | v3.81,39.37 v97.03,39.37 | v97.03,40.89 v3.81,40.89 | v3.81,42.42 v97.03,42.42 | v97.03,43.94 v3.81,43.94 | v3.81,45.47 v97.03,45.47 | v97.03,46.99 v3.81,46.99 | v3.81,48.51 v97.03,48.51 | v97.03,50.04 v3.81,50.04 | v3.81,51.56 v97.03,51.56 | v97.03,53.09 v3.81,53.09 | v3.81,54.61 v97.03,54.61 | v97.03,56.13 v3.81,56.13 | v3.81,57.66 v97.03,57.66 | v97.03,59.18 v3.81,59.18 | v3.81,60.71 v97.03,60.71 | v97.03,62.23 v3.81,62.23 | v3.81,63.75 v97.03,63.75 | v97.03,65.28 v3.81,65.28 | v3.81,66.8 v97.03,66.8 | v97.03,68.33 v3.81,68.33 | v3.81,69.85 v97.03,69.85 | v97.03,71.37 v3.81,71.37 | v3.81,72.9 v97.03,72.9 | v97.03,74.42 v3.81,74.42 | v3.81,75.95 v97.03,75.95 | v97.03,77.47 v3.81,77.47 | v3.81,78.99 v97.03,78.99 | v97.03,80.52 v3.81,80.52 | v3.81,82.04 v97.03,82.04 | v97.03,83.57 v3.81,83.57 | v3.81,85.09 v97.03,85.09 | v97.03,86.61 v3.81,86.61 | v3.81,88.14 v97.03,88.14 | v97.03,89.66 v3.81,89.66 | v3.81,91.19 v97.03,91.19 | v97.03,92.71 v3.81,92.71 | v3.81,94.23 v97.03,94.23 | v97.03,95.76 1.02,95.76 1.02,8.13 2.54,6.6 XS1.2

### Text on the board
bNames: (Bobricius) - PeMi Technology / Factory For Materializing Dreams | https://www.youtube.com/bobricius / https://hackaday.io/bobricius / www.tindie.com/stores/bobricius/ / www.tindie.com/stores/kitsforkids/ | www.pemi.technology | PCB Prototype the Easy Way / Full feature custom PCB prototype service. | Y | X | A | B | A | B | A | B | A | B